# EasyEDA schematic SCH_Esp-Wled-(ready)_2024-12-15.json
TITLE: Sheet_1; REV: 1.0; Date: 2024-11-04; Sheet: 1/1; Drawn By: dkwolf1; Company: Your Company
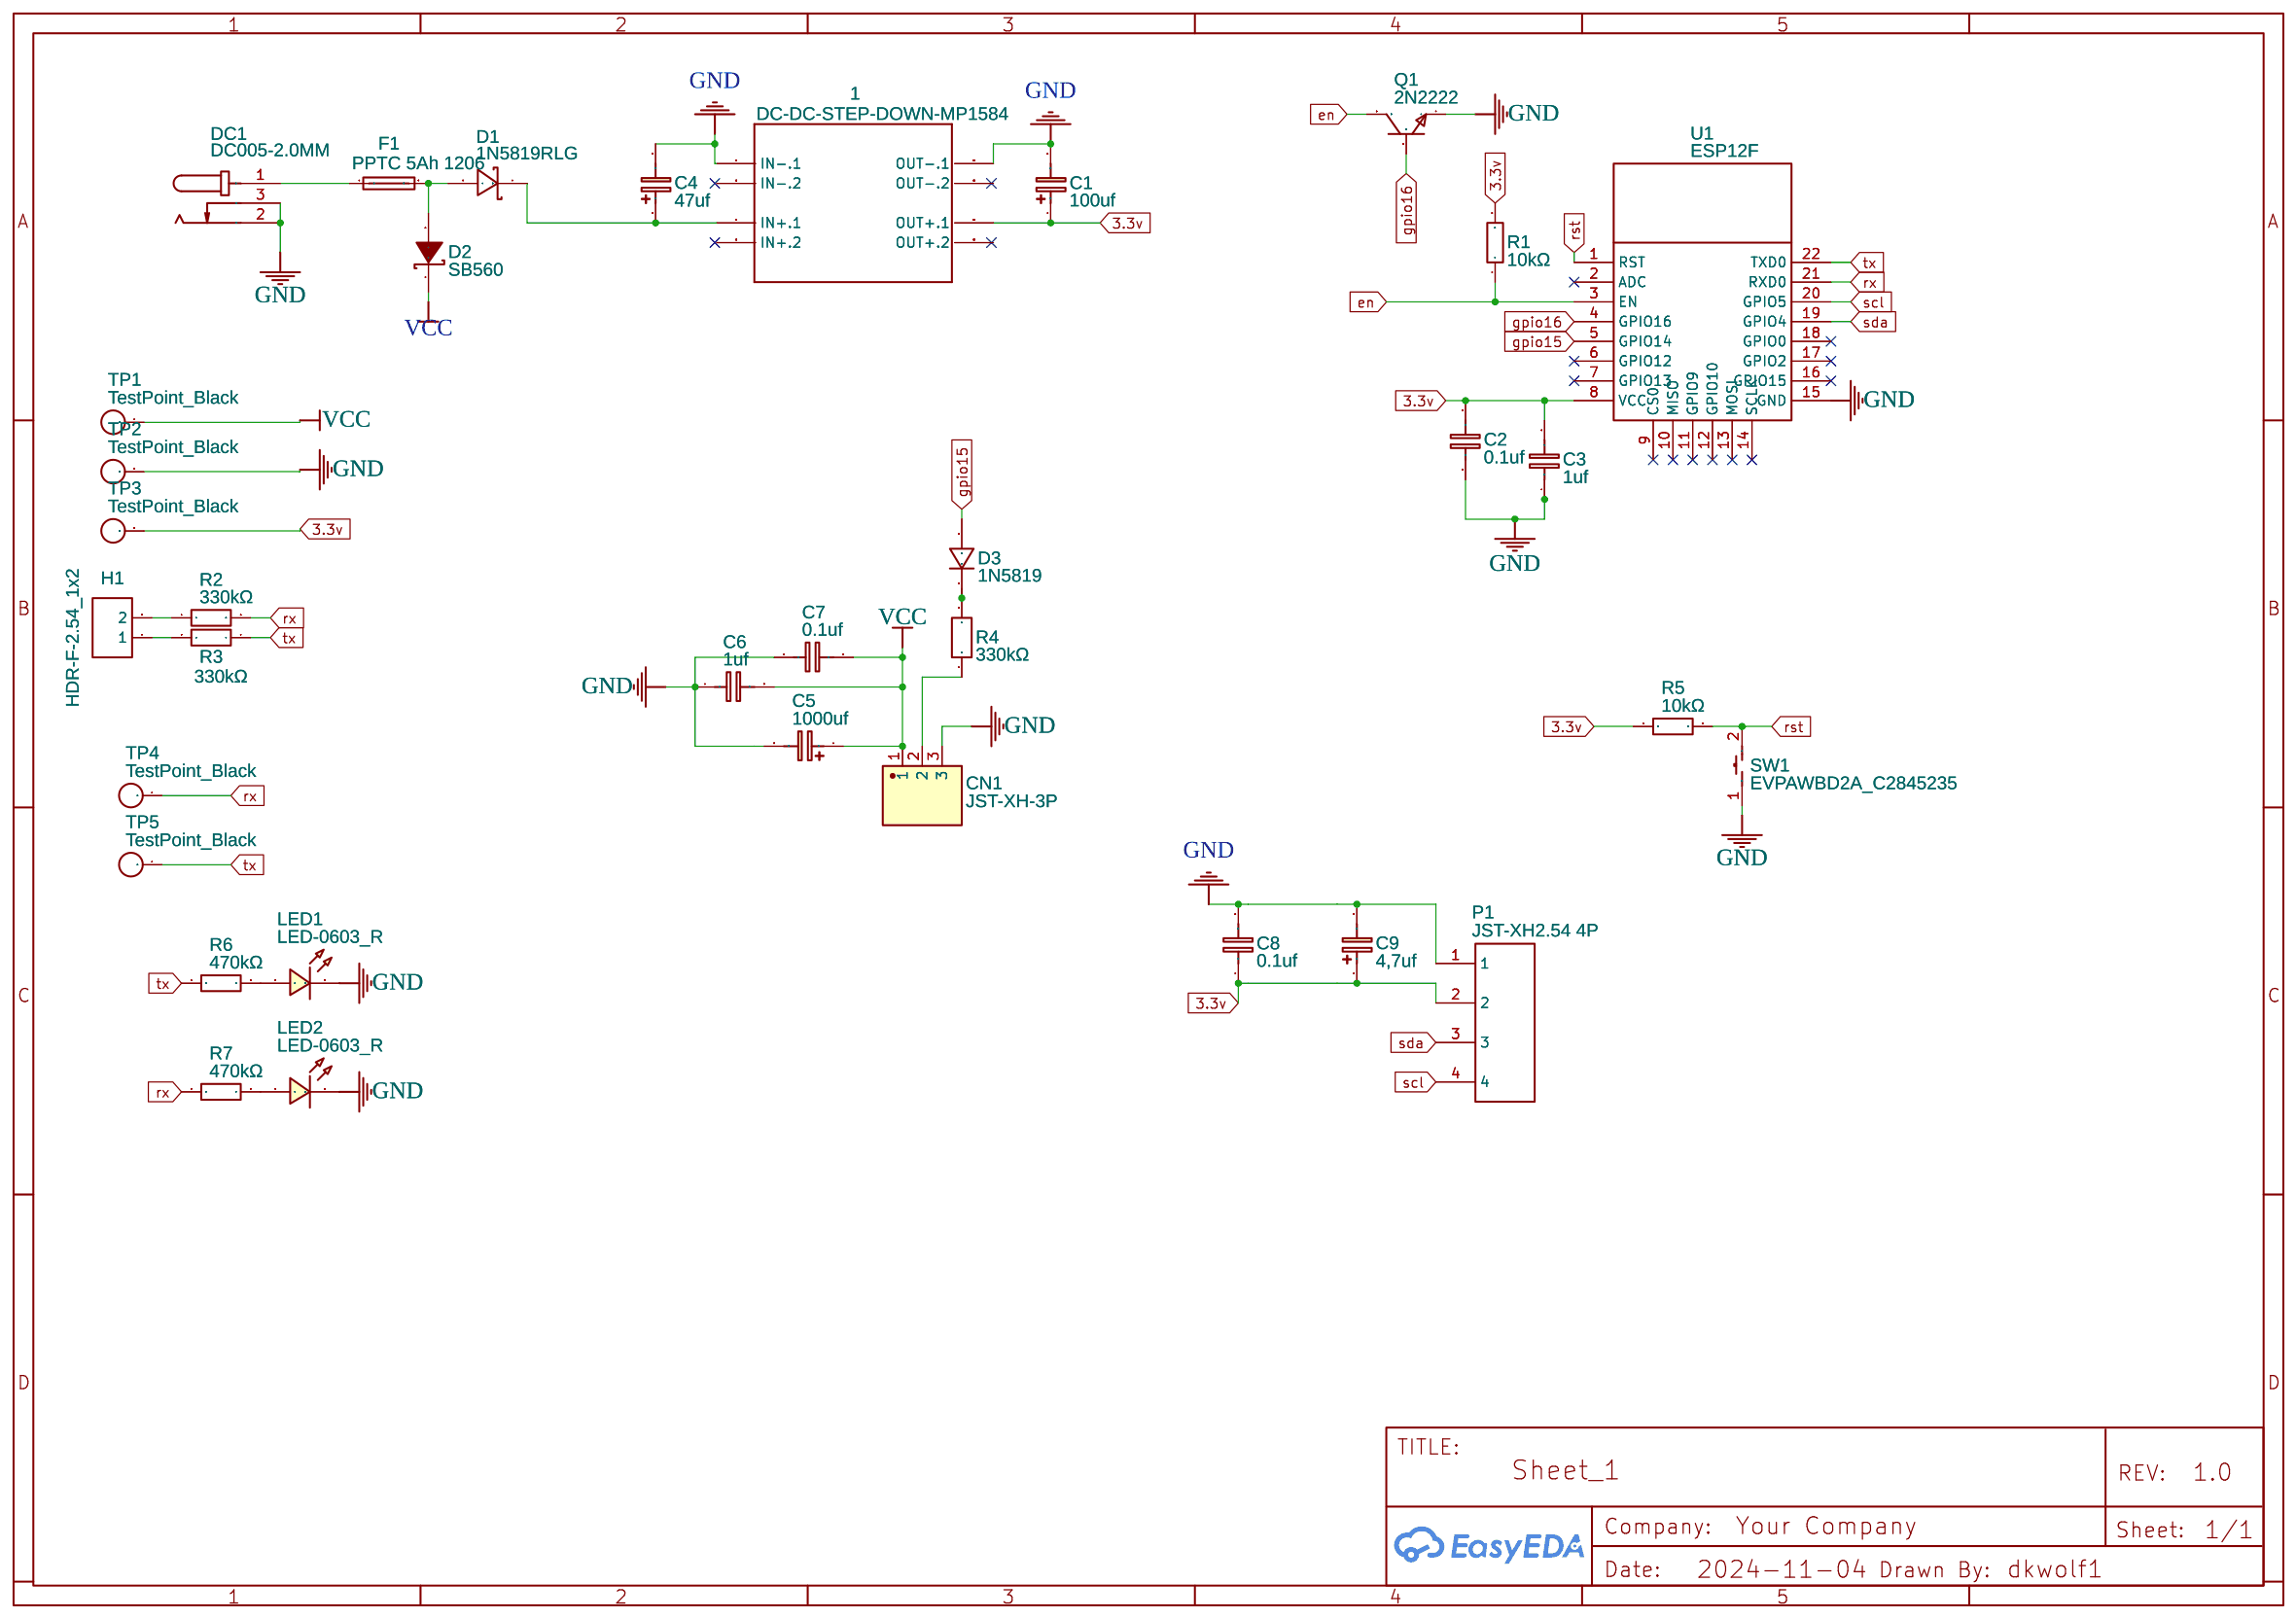
[diagram p0: schematic sheet]

## Parts
1  DC-DC-STEP-DOWN-MP1584  [DC-DC-STEP-DOWN-MP1584]
C1  100uf  [CAP-D5.0×H5.5]
C2  0.1uf  [C0603]
C3  1uf  [C0603]
C4  47uf  [CAP-D5.0×H5.5]
C5  1000uf  [CAP-D8.0×H10.5]
C6  1uf  [C0603]
C7  0.1uf  [C0603]
C8  0.1uf  [C0603]
C9  4,7uf  [CAP-D5.0×H5.5]
CN1  JST-XH-3P  [JST-XH-3P]
D1  1N5819RLG  [DO-41_BD2.4-L4.7-P8.70-D0.9-RD]
D2  SB560  [DO-201AD_BD5.3-L8.4-P12.50-D1.4-RD]
D3  1N5819  [DO-41_BD2.4-L4.7-P8.70-D0.9-RD]
DC1  DC005-2.0MM  [DC-IN-TH_DC005]
F1  PPTC 5Ah 1206  [F1206]
H1  HDR-F-2.54_1x2  [HDR-F-2.54_1X2]
LED1  LED-0603_R  [LED0603_RED]
LED2  LED-0603_R  [LED0603_RED]
P1  JST-XH2.54 4P  [JST-XH 4P]
Q1  2N2222  [TO-92-3_L4.9-W3.7-P1.27-L]
R1  10kΩ  [R1206]
R2  330kΩ  [R1206]
R3  330kΩ  [R1206]
R4  330kΩ  [R1206]
R5  10kΩ  [R1206]
R6  470kΩ  [R1206]
R7  470kΩ  [R1206]
SW1  EVPAWBD2A_C2845235  [SW-SMD_L3.0-W2.0-LS3.5]
TP1  TestPoint_Black  [TEST_TESTPOINT]
TP2  TestPoint_Black  [TEST_TESTPOINT]
TP3  TestPoint_Black  [TEST_TESTPOINT]
TP4  TestPoint_Black  [TEST_TESTPOINT]
TP5  TestPoint_Black  [TEST_TESTPOINT]
U1  ESP12F  [ESP12F-SMD]

## Library data of the parts
1 = DC-DC-STEP-DOWN-MP1584: Contributor: albautista
C1 C4 C9 = CE_SMD_D5.0×H5.5_EU: Contributor: LCEDA_Lib
C2 C3 C6-C8 = C_0603_EU: Contributor: LCEDA_Lib
C5 = CE_SMD_D8.0×H10.5_EU: Contributor: LCEDA_Lib
CN1 = JST-XH-3P: Manufacturer: JST; Manufacturer Part: B4B-XH-A(LF)(SN); Supplier Part: 455-2249-ND; Supplier: Digi-Key; link: http://www.jst-mfg.com/product/pdf/eng/eXH.pdf; Contributor: Mateusz Szczerba; Convert to PCB: Yes; Add into BOM: Yes
D1 = 1N5819RLG: Contributor: LCSC; Supplier: LCSC; Supplier Part: C88393; Manufacturer: onsemi(安森美); JLCPCB Part Class: Extended Part
D2 = SB560: Contributor: LCSC; Supplier: LCSC; Manufacturer: SMC(桑德斯); Supplier Part: C139684; JLCPCB Part Class: Extended Part
D3 = 1N4007: Supplier: LCSC; Manufacturer: SEMTECH; Supplier Part: C106903; Contributor: LCEDA_Lib
DC1 = DC005-2.0MM: Supplier: LCSC; Manufacturer: SOFNG; Supplier Part: C111567
F1 = JK-NSMD050-24V: Contributor: LCSC; Supplier: LCSC; Supplier Part: C369160; Manufacturer: JK(金科); Manufacturer Part: JK-nSMD050-24; JLCPCB Part Class: Extended Part
H1 = HDR-F-2.54_1x2: Supplier Part: C49661; Supplier: LCSC; Contributor: LCEDA_Lib
LED1 LED2 = LED-0603_R: Manufacturer: EVERLIGHT(台湾亿光); Manufacturer Part: 19-217/R6C-AL1M2VY/3T; Supplier Part: C72044; Supplier: LCSC; Contributor: LCEDA_01
P1 = JST-XH2.54 4P: Contributor: zero333
Q1 = 2N2222: Contributor: LCSC; Supplier: LCSC; Manufacturer: ST(先科); Manufacturer Part: 2N2222A; Supplier Part: C118536; JLCPCB Part Class: Extended Part
R1 R5 = RC1206JR-0710KL: Supplier: LCSC; Manufacturer: YAGEO(国巨); Supplier Part: C136460; JLCPCB Part Class: Extended Part
R2 R3 = 1206W4F3303T5E: Supplier: LCSC; Manufacturer: UNI-ROYAL(厚声); Supplier Part: C17929; JLCPCB Part Class: Extended Part
R4 = RC1206JR-7W330KL: Contributor: LCSC; Supplier: LCSC; Supplier Part: C606188; Manufacturer: YAGEO(国巨); JLCPCB Part Class: Extended Part
R6 R7 = RC1206FR-07470KL: Supplier: LCSC; Manufacturer: YAGEO(国巨); Supplier Part: C137273; JLCPCB Part Class: Extended Part
SW1 = EVPAWBD2A_C2845235: Contributor: LCSC; Supplier: LCSC; Supplier Part: C2845235; Manufacturer: PANASONIC(松下); Manufacturer Part: EVPAWBD2A; JLCPCB Part Class: Extended Part
TP1-TP5 = TEST_TESTPOINT: Contributor: best420
U1 = ESP12F: Contributor: sergio.alan

## Nets
3.3v: 1.OUT+.1 C1.1 C2.2 C3.2 C8.1 C9.1 P1.2 R1.2 R5.1 TP3.1(2) U1.8(VCC)
GND: 1.IN-.1 1.OUT-.1 C1.2 C2.1 C3.1 C4.2 C5.2 C6.1 C7.1 C8.2 C9.2 CN1.3 DC1.2 DC1.3 LED1.2 LED2.2 P1.1 Q1.1(E) SW1.1 TP2.1(2) U1.15(GND)
VCC: C5.1 C6.2 C7.2 CN1.1 D2.1(K) TP1.1(2)
en: Q1.3(C) R1.1 U1.3(EN)
gpio15: D3.2 U1.5(GPIO14)
gpio16: Q1.2(B) U1.4(GPIO16)
rst: R5.2 SW1.2 U1.1(RST)
rx: R2.2 R7.1 TP4.1(2) U1.21(RXD0)
scl: P1.4 U1.20(GPIO5)
sda: P1.3 U1.19(GPIO4)
tx: R3.1 R6.1 TP5.1(2) U1.22(TXD0)
Net-(1-IN+.1): 1.IN+.1 C4.1 D1.1(C)
Net-(CN1-2): CN1.2 R4.1
Net-(D1-2): D1.2(A) D2.2(A) F1.2
Net-(D3-1): D3.1 R4.2
Net-(DC1-1): DC1.1 F1.1
Net-(H1-1): H1.1 R3.2
Net-(H1-2): H1.2 R2.1
Net-(LED1-1): LED1.1 R6.2
Net-(LED2-1): LED2.1 R7.2

Not connected (* = marked no-connect by the designer): 1 IN+.2 IN-.2 OUT+.2 OUT-.2; U1 2(ADC)* 6(GPIO12)* 7(GPIO13)* 9(CS0)* 10(MISO)* 11(GPIO9)* 12(GPIO10)* 13(MOSI)* 14(SCLK)* 16(GPIO15)* 17(GPIO2)* 18(GPIO0)*
